# EasyEDA schematic SCH_car for_2024-01-24.json

## Sheets
1 Sheet_1: TITLE: Sheet_1; REV: 1.0; Date: 2024-01-22; Sheet: 1/1; Drawn By: mdrakibislam719; Company: Your Company
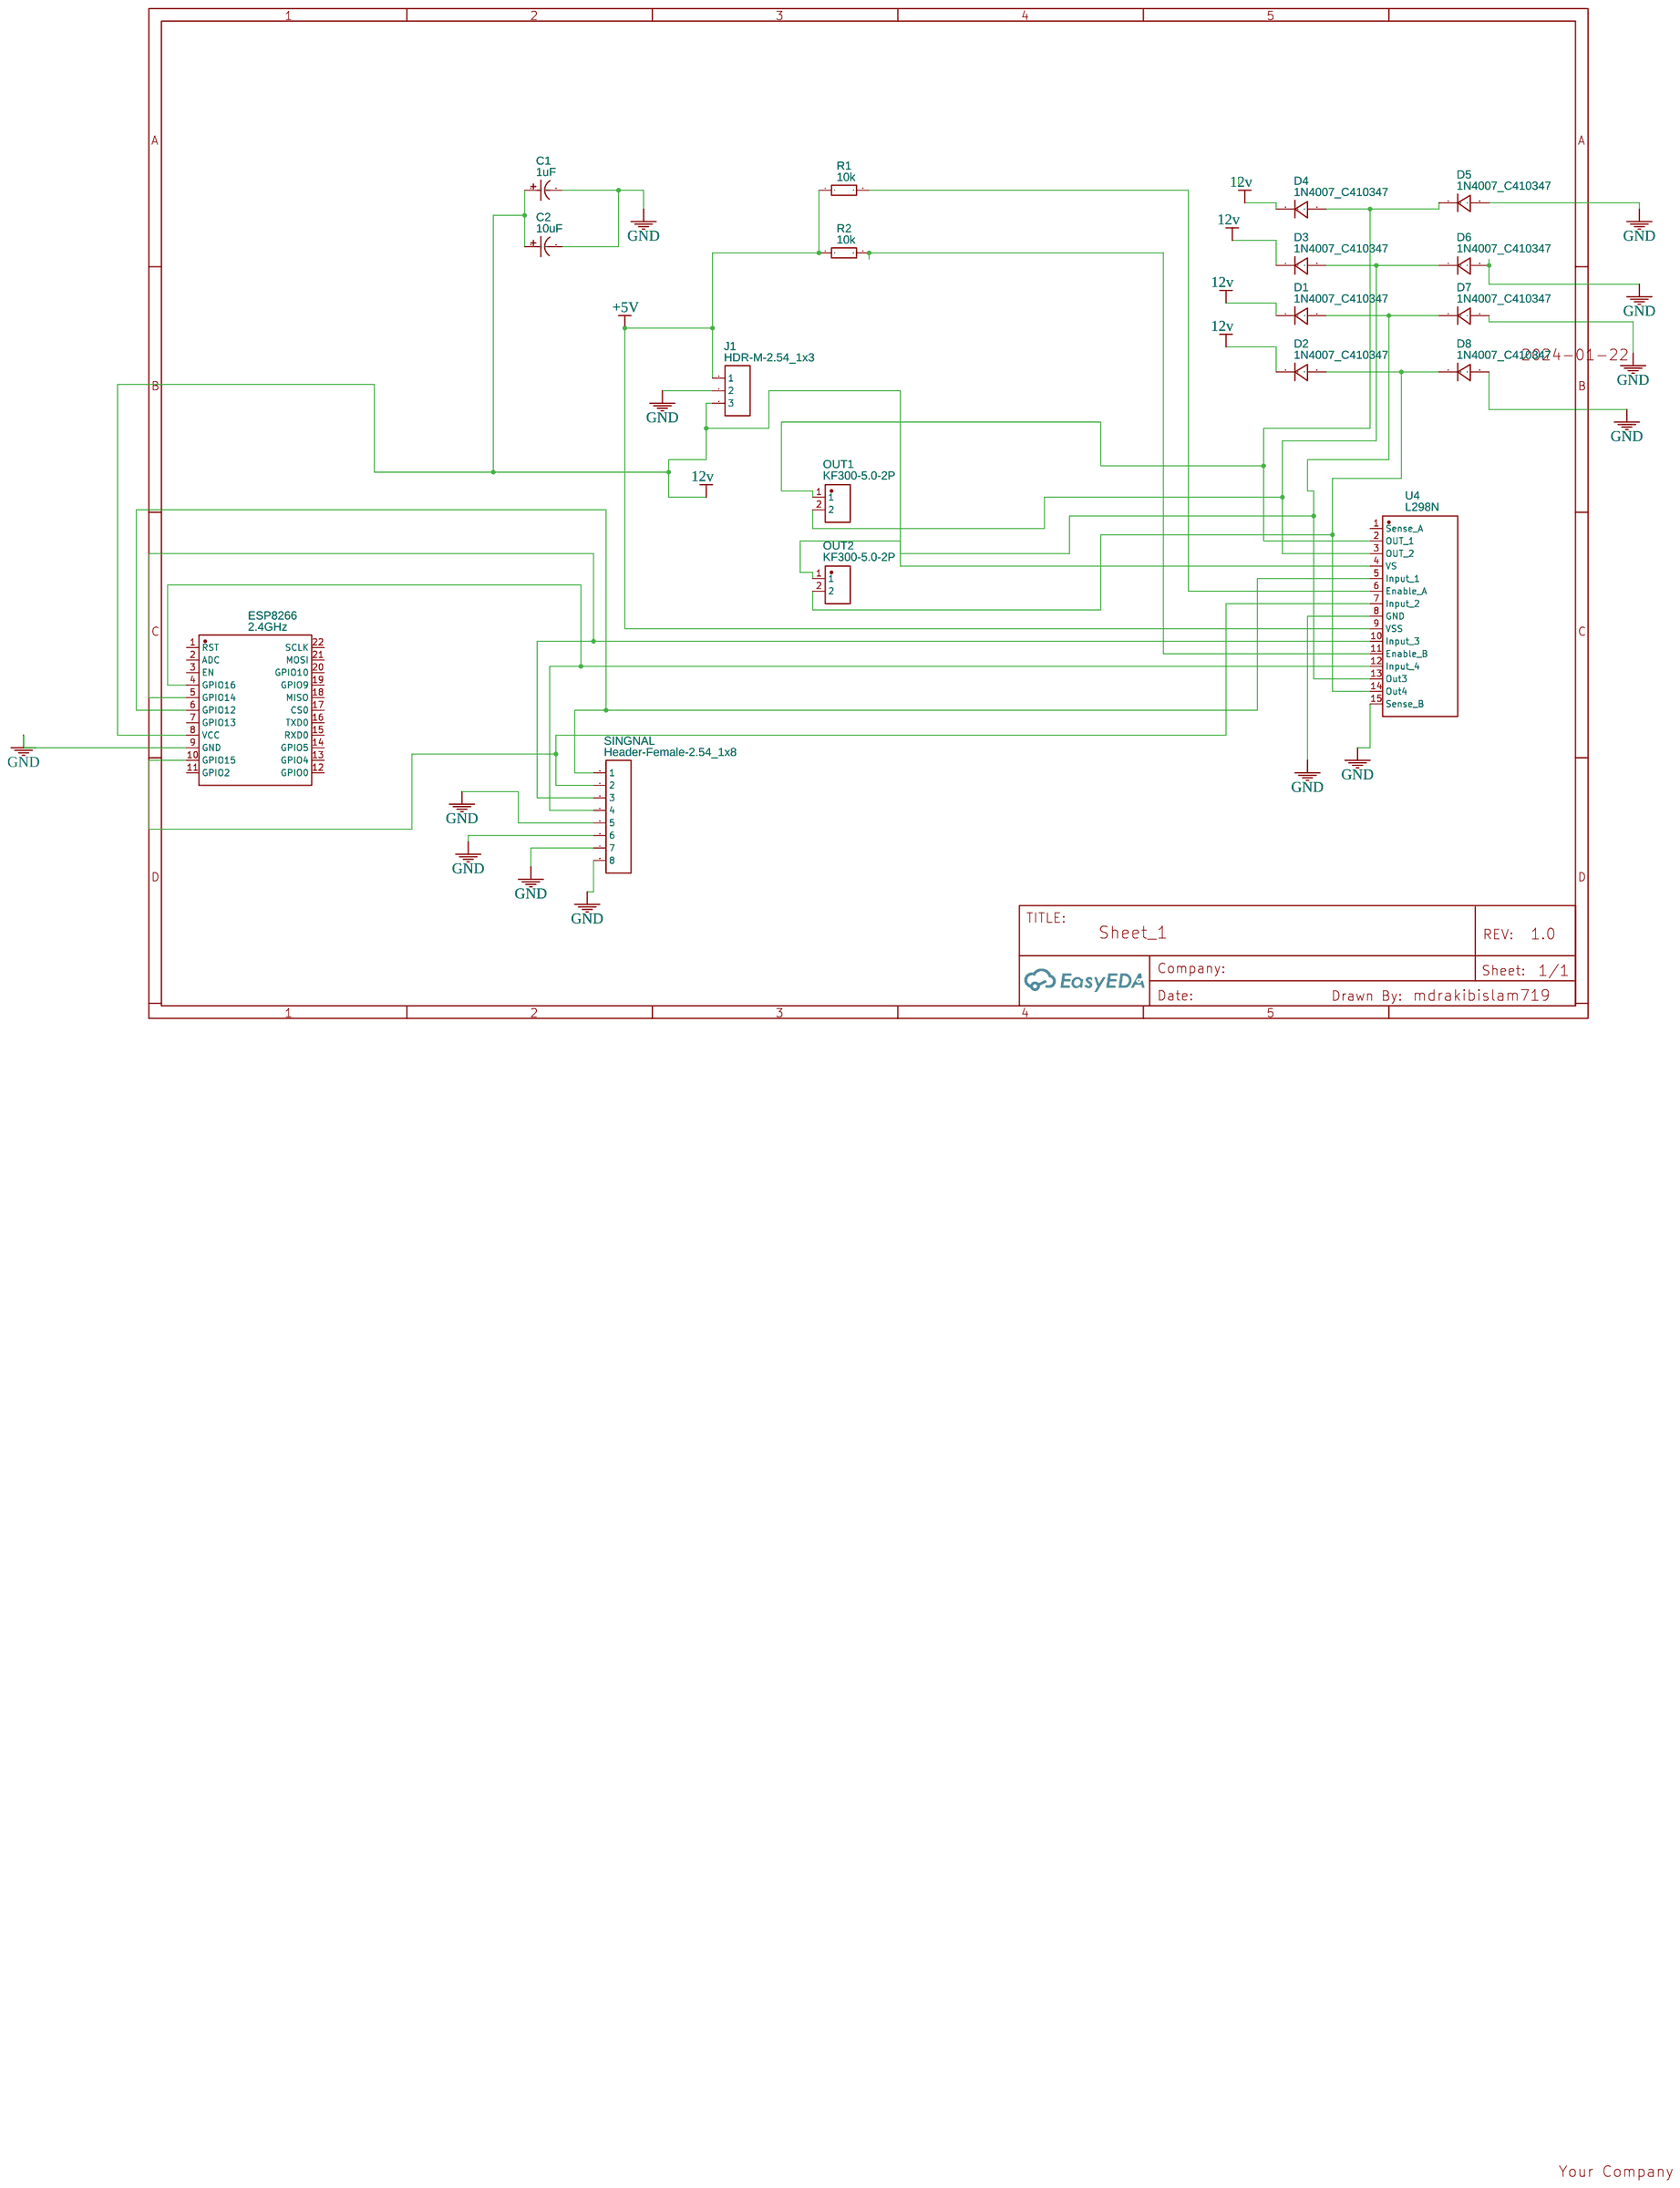
[diagram p0: Sheet_1]
2 Sheet_2: TITLE: Sheet_2
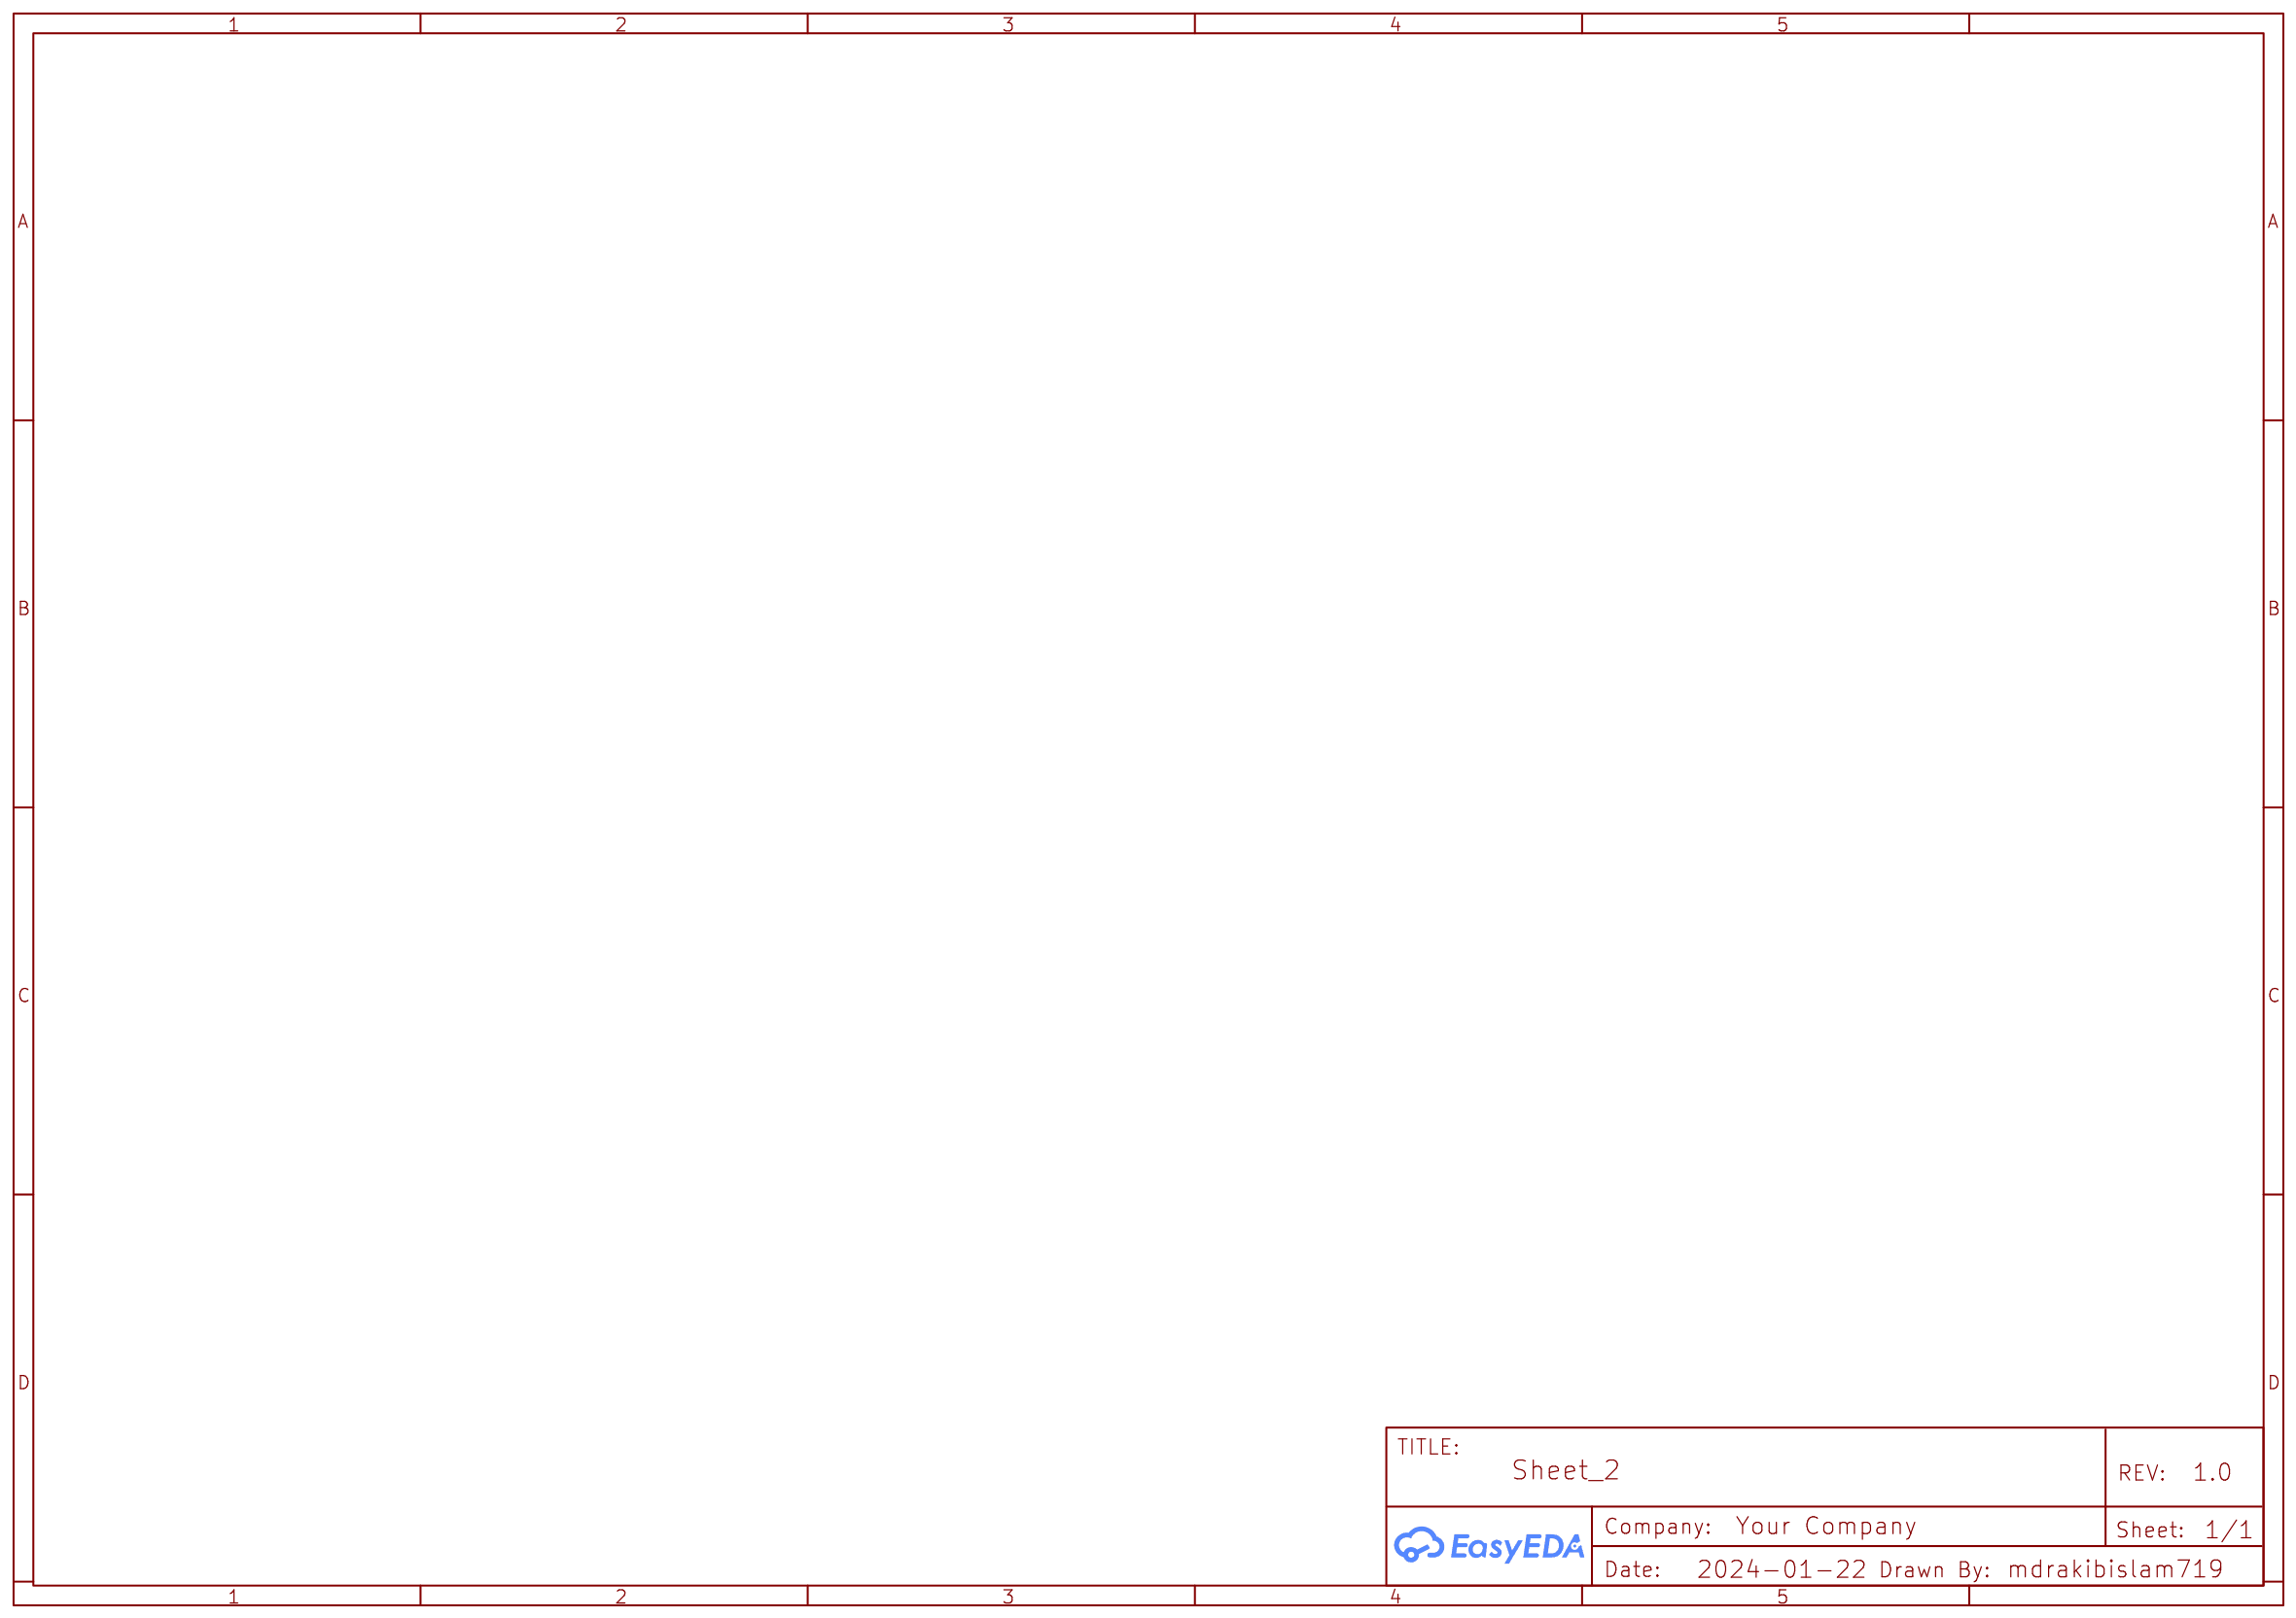
[diagram p1: Sheet_2]

## Parts
C1  1uF  [CAP-TH_BD4.0-P1.50-D0.8-FD]
C2  10uF  [CAP-TH_BD5.0-P2.00-D0.8-FD]
D1  1N4007_C410347  [DO-41_BD2.4-L4.7-P8.70-D0.9-RD]
D2  1N4007_C410347  [DO-41_BD2.4-L4.7-P8.70-D0.9-RD]
D3  1N4007_C410347  [DO-41_BD2.4-L4.7-P8.70-D0.9-RD]
D4  1N4007_C410347  [DO-41_BD2.4-L4.7-P8.70-D0.9-RD]
D5  1N4007_C410347  [DO-41_BD2.4-L4.7-P8.70-D0.9-RD]
D6  1N4007_C410347  [DO-41_BD2.4-L4.7-P8.70-D0.9-RD]
D7  1N4007_C410347  [DO-41_BD2.4-L4.7-P8.70-D0.9-RD]
D8  1N4007_C410347  [DO-41_BD2.4-L4.7-P8.70-D0.9-RD]
ESP8266  2.4GHz  [WIFIM-SMD_ESP-12F-ESP8266MOD]
J1  HDR-M-2.54_1x3  [HDR-M-2.54_1X3]
OUT1  KF300-5.0-2P  [CONN-TH_P5.00_KF300-5.0-2P]
OUT2  KF300-5.0-2P  [CONN-TH_P5.00_KF300-5.0-2P]
R1  10k  [RES-TH_BD3.0-L9.5-P13.50-D0.6]
R2  10k  [RES-TH_BD3.0-L9.5-P13.50-D0.6]
SINGNAL  Header-Female-2.54_1x8  [HDR-TH_8P-P2.54-V-F-1]
U4  L298N  [MULTIWATT-15_L19.6-W5.0-P1.27-L]

## Library data of the parts
C1 = 1uF 50V 4*5: Supplier: LCSC; Manufacturer: CX(承兴); Manufacturer Part: KF105M050C05RR0VH2FP0; Supplier Part: C47848; JLCPCB Part Class: Extended Part
C2 = 10uF 25V 5*11: Supplier: LCSC; Manufacturer: CX(承兴); Manufacturer Part: KM106M025D11RR0VH2FP0; Supplier Part: C43347; JLCPCB Part Class: Extended Part
D1-D8 = 1N4007_C410347: Contributor: LCSC; Supplier: LCSC; Supplier Part: C410347; Manufacturer: GOOD-ARK(固锝); Manufacturer Part: 1N4007-TB; JLCPCB Part Class: Extended Part
ESP8266 = ESP-12F(ESP8266MOD): Supplier: LCSC; Manufacturer: Ai-Thinker(安信可); Supplier Part: C82891; JLCPCB Part Class: Extended Part
J1 = HDR-M-2.54_1x3: Supplier Part: C180248; Supplier: LCSC; Contributor: LCEDA_Lib
OUT1 OUT2 = KF300-5.0-2P: Contributor: LCSC; Supplier: LCSC; Supplier Part: C474885; Manufacturer: KEFA(科发); JLCPCB Part Class: Extended Part
R1 R2 = 750Ω: Supplier: LCSC; Manufacturer Part: 7501/2w5%; Supplier Part: C48642
SINGNAL = Header-Female-2.54_1x8: Supplier: LCSC; Manufacturer: BOOMELE(博穆精密); Manufacturer Part: 2.54-1*8P母环保; Supplier Part: C27438; JLCPCB Part Class: Extended Part
U4 = L298N: Contributor: LCSC; Supplier: LCSC; Supplier Part: C434589; Manufacturer: HGSEMI(华冠); JLCPCB Part Class: Extended Part

## Nets
12v: C1.1 C2.1 D1.1(C) D2.1(C) D3.1(C) D4.1(C) ESP8266.8(VCC) J1.3 U4.4(VS)
+5V: J1.1 R1.1 R2.1 U4.9(VSS)
GND: C1.2 C2.2 D5.2(A) D6.2(A) D7.2(A) D8.2(A) ESP8266.9(GND) J1.2 SINGNAL.5 SINGNAL.6 SINGNAL.7 SINGNAL.8 U4.8(GND) U4.15(Sense B)
Net-(D1-2): D1.2(A) D7.1(C) OUT2.1 U4.13(Out3)
Net-(D2-2): D2.2(A) D8.1(C) OUT2.2 U4.14(Out4)
Net-(D3-2): D3.2(A) D6.1(C) OUT1.2 U4.3(OUT 2)
Net-(D4-2): D4.2(A) D5.1(C) OUT1.1 U4.2(OUT 1)
Net-(ESP8266-4): ESP8266.4(GPIO16) SINGNAL.4 U4.12(Input 4)
Net-(ESP8266-5): ESP8266.5(GPIO14) SINGNAL.3 U4.10(Input 3)
Net-(ESP8266-6): ESP8266.6(GPIO12) SINGNAL.1 U4.5(Input 1)
Net-(ESP8266-10): ESP8266.10(GPIO15) SINGNAL.2 U4.7(Input 2)
Net-(R1-2): R1.2 U4.6(Enable A)
Net-(R2-2): R2.2 U4.11(Enable B)

Not connected (* = marked no-connect by the designer): ESP8266 1(RST) 2(ADC) 3(EN) 7(GPIO13) 11(GPIO2) 12(GPIO0) 13(GPIO4) 14(GPIO5) 15(RXD0) 16(TXD0) 17(CS0) 18(MISO) 19(GPIO9) 20(GPIO10) 21(MOSI) 22(SCLK); U4 1(Sense A)
